# Altium project ADC-RDC.PrjPcb
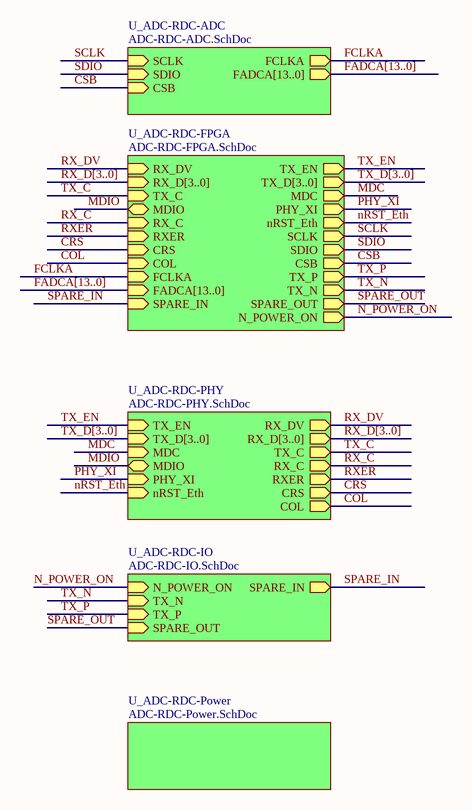
[diagram p0: ADC-RDC.SchDoc]
6 sheets, 188 parts. Net scope: hierarchical (ports join the sheet entries above them; power ports are global).
Board file: ADC-RDC.PcbDoc
Sheets:
  ADC-RDC.SchDoc
    U_ADC-RDC-ADC = ADC-RDC-ADC.SchDoc
    U_ADC-RDC-PHY = ADC-RDC-PHY.SchDoc
    U_ADC-RDC-Power = ADC-RDC-Power.SchDoc
    U_ADC-RDC-IO = ADC-RDC-IO.SchDoc
    U_ADC-RDC-FPGA = ADC-RDC-FPGA.SchDoc

## Sheet ADC-RDC.SchDoc
size A4

### Sub-sheets
U_ADC-RDC-ADC = ADC-RDC-ADC.SchDoc: SCLK (in), SDIO (in), CSB (in), FCLKA (out), FADCA[13..0] (out)
U_ADC-RDC-FPGA = ADC-RDC-FPGA.SchDoc: TX_EN (out), TX_D[3..0] (out), RX_DV (in), RX_D[3..0] (in), TX_C (in), MDC (out), MDIO (bidir), PHY_XI (out), nRST_Eth (out), RX_C (in), RXER (in), CRS (in), COL (in), FCLKA (in), FADCA[13..0] (in), SCLK (out), SDIO (out), CSB (out), TX_P (out), TX_N (out), SPARE_OUT (out), SPARE_IN (in), N_POWER_ON (out)
U_ADC-RDC-IO = ADC-RDC-IO.SchDoc: N_POWER_ON (in), TX_P (in), TX_N (in), SPARE_OUT (in), SPARE_IN (out)
U_ADC-RDC-PHY = ADC-RDC-PHY.SchDoc: TX_EN (in), TX_D[3..0] (in), RX_DV (out), RX_D[3..0] (out), TX_C (out), MDC (in), MDIO (bidir), PHY_XI (in), nRST_Eth (in), RX_C (out), RXER (out), CRS (out), COL (out)
U_ADC-RDC-Power = ADC-RDC-Power.SchDoc: no entries

### Nets
COL: sheet U_ADC-RDC-PHY/COL, sheet U_ADC-RDC-FPGA/COL
CRS: sheet U_ADC-RDC-PHY/CRS, sheet U_ADC-RDC-FPGA/CRS
CSB: sheet U_ADC-RDC-ADC/CSB, sheet U_ADC-RDC-FPGA/CSB
FCLKA: sheet U_ADC-RDC-ADC/FCLKA, sheet U_ADC-RDC-FPGA/FCLKA
MDC: sheet U_ADC-RDC-PHY/MDC, sheet U_ADC-RDC-FPGA/MDC
MDIO: sheet U_ADC-RDC-PHY/MDIO, sheet U_ADC-RDC-FPGA/MDIO
N_POWER_ON: sheet U_ADC-RDC-IO/N_POWER_ON, sheet U_ADC-RDC-FPGA/N_POWER_ON
nRST_Eth: sheet U_ADC-RDC-PHY/nRST_Eth, sheet U_ADC-RDC-FPGA/nRST_Eth
PHY_XI: sheet U_ADC-RDC-PHY/PHY_XI, sheet U_ADC-RDC-FPGA/PHY_XI
RX_C: sheet U_ADC-RDC-PHY/RX_C, sheet U_ADC-RDC-FPGA/RX_C
RX_DV: sheet U_ADC-RDC-PHY/RX_DV, sheet U_ADC-RDC-FPGA/RX_DV
RXER: sheet U_ADC-RDC-PHY/RXER, sheet U_ADC-RDC-FPGA/RXER
SCLK: sheet U_ADC-RDC-ADC/SCLK, sheet U_ADC-RDC-FPGA/SCLK
SDIO: sheet U_ADC-RDC-ADC/SDIO, sheet U_ADC-RDC-FPGA/SDIO
SPARE_IN: sheet U_ADC-RDC-IO/SPARE_IN, sheet U_ADC-RDC-FPGA/SPARE_IN
SPARE_OUT: sheet U_ADC-RDC-IO/SPARE_OUT, sheet U_ADC-RDC-FPGA/SPARE_OUT
TX_C: sheet U_ADC-RDC-PHY/TX_C, sheet U_ADC-RDC-FPGA/TX_C
TX_EN: sheet U_ADC-RDC-PHY/TX_EN, sheet U_ADC-RDC-FPGA/TX_EN
TX_N: sheet U_ADC-RDC-IO/TX_N, sheet U_ADC-RDC-FPGA/TX_N
TX_P: sheet U_ADC-RDC-IO/TX_P, sheet U_ADC-RDC-FPGA/TX_P

### Buses and harness runs
bus FADCA[13..0] = sheet U_ADC-RDC-ADC/FADCA[13..0]
bus FADCA[13..0] = sheet U_ADC-RDC-FPGA/FADCA[13..0]
bus RX_D[3..0] = sheet U_ADC-RDC-FPGA/RX_D[3..0]
bus RX_D[3..0] = sheet U_ADC-RDC-PHY/RX_D[3..0]
bus TX_D[3..0] = sheet U_ADC-RDC-FPGA/TX_D[3..0]
bus TX_D[3..0] = sheet U_ADC-RDC-PHY/TX_D[3..0]

## Sheet ADC-RDC-ADC.SchDoc
size A3
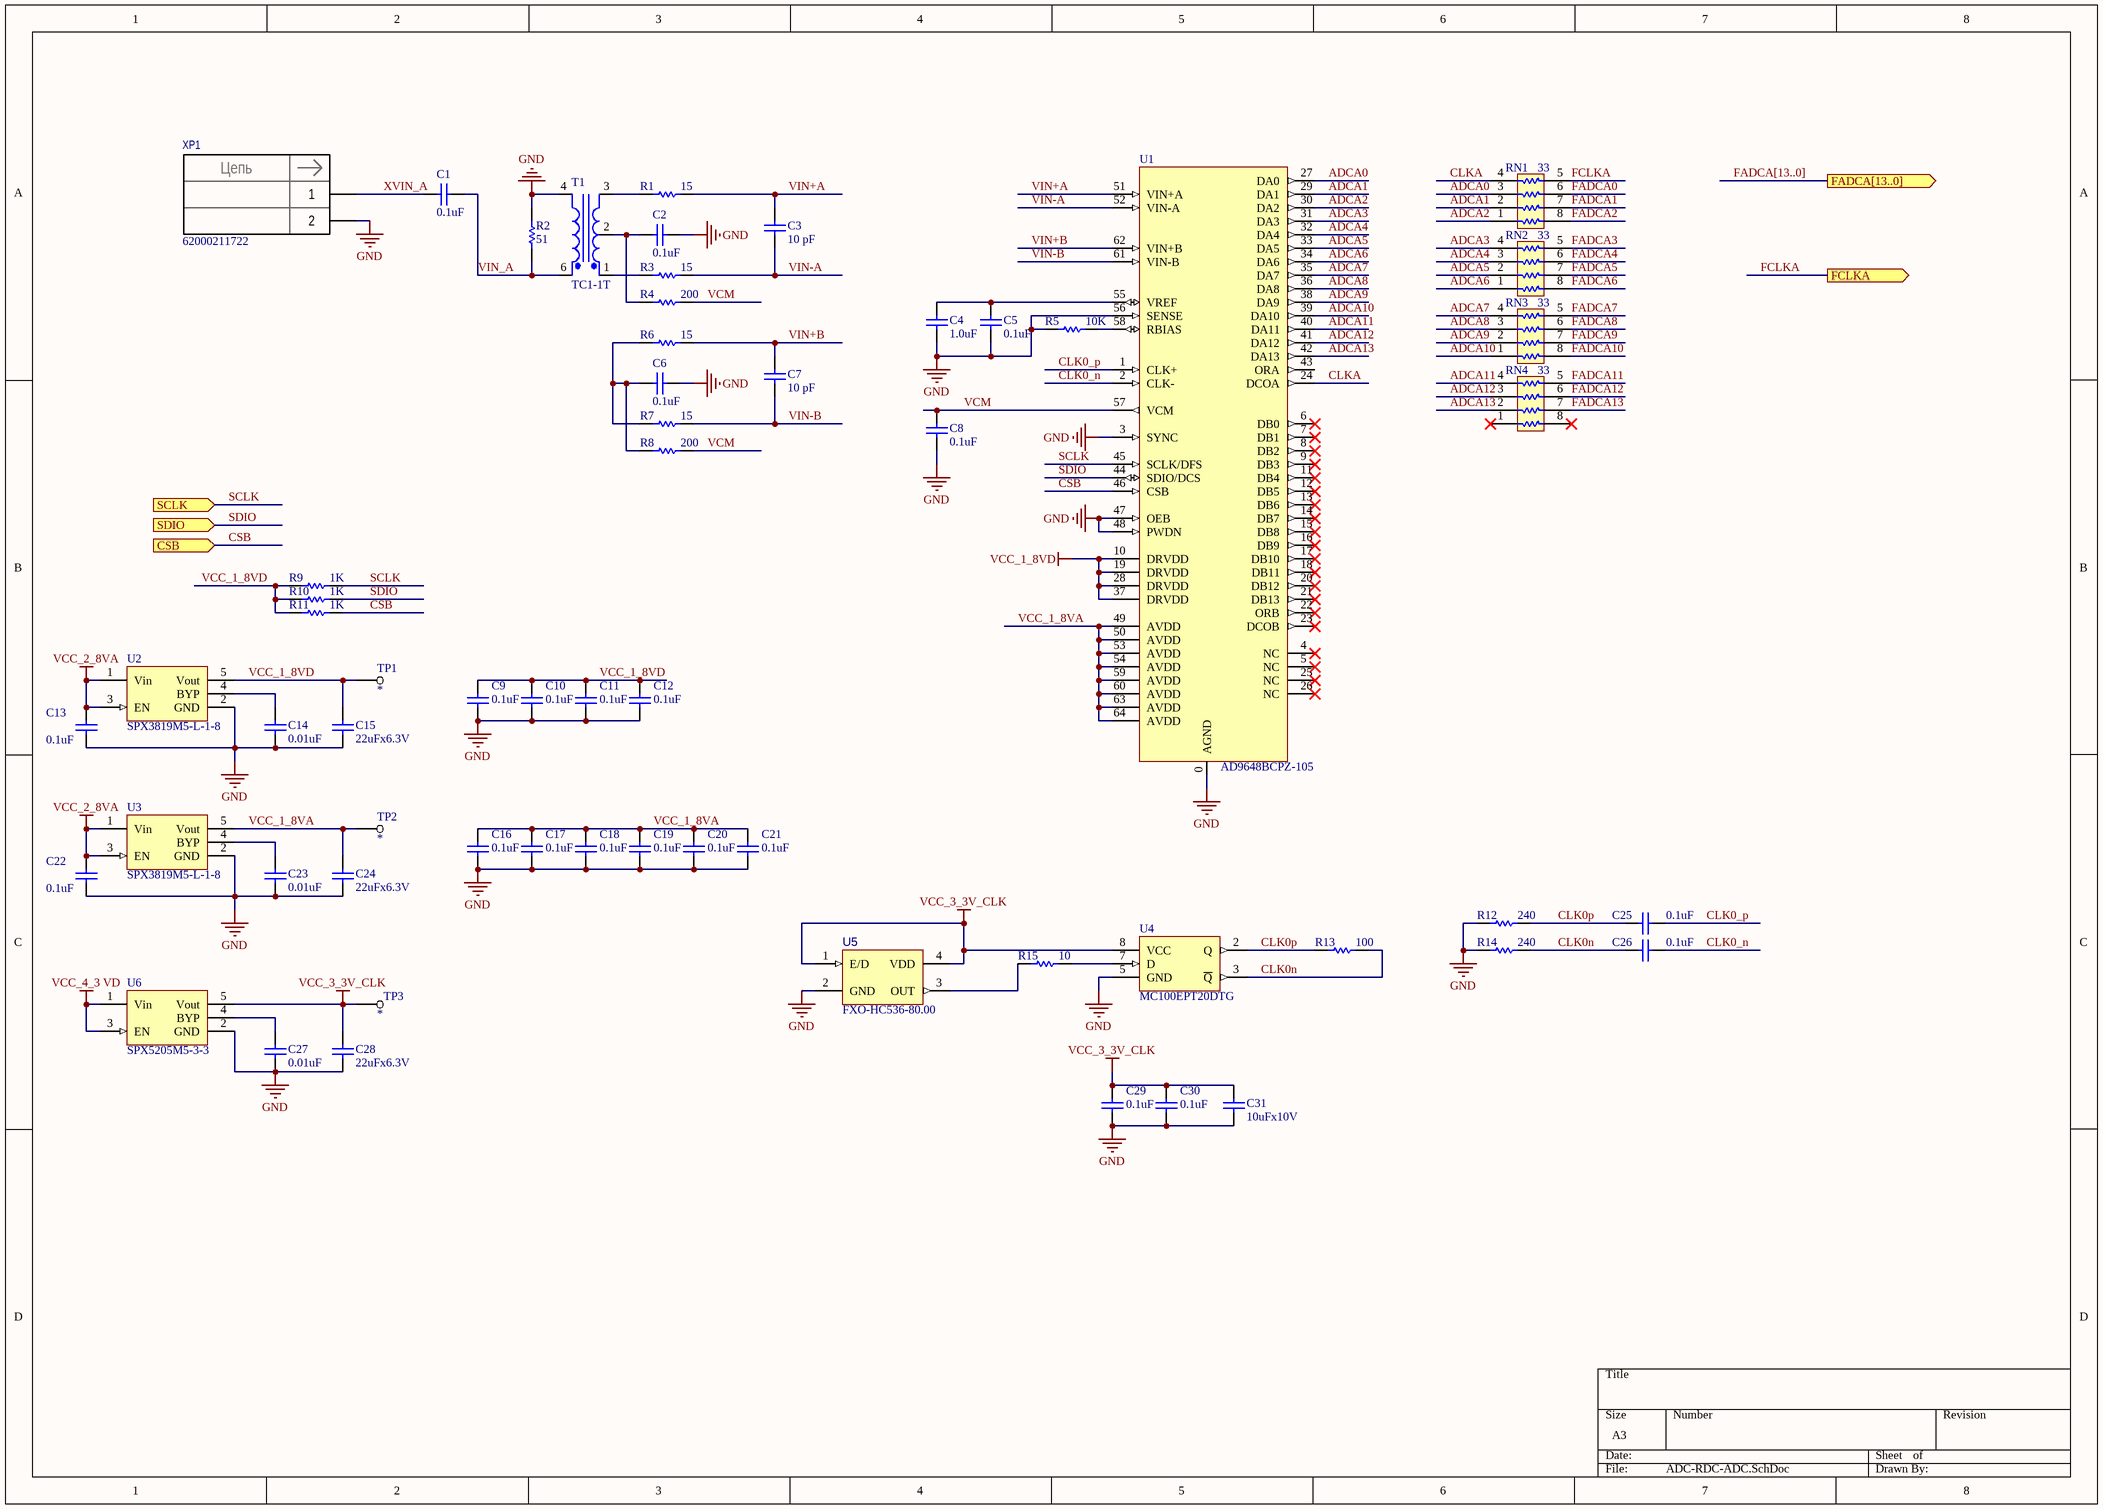
[diagram p1: ADC-RDC-ADC.SchDoc]

### Parts
C1  0.1uF  [C0603]
C2  0.1uF  [C0603]
C3  10 pF  [C0603]
C4  1.0uF  [C0603L]
C5  0.1uF  [C0603L]
C6  0.1uF  [C0603]
C7  10 pF  [C0603]
C8  0.1uF  [C0603L]
C9  0.1uF  [C0603]
C10  0.1uF  [C0603]
C11  0.1uF  [C0603]
C12  0.1uF  [C0603]
C13  0.1uF  [C0603]
C14  0.01uF  [C0603]
C15  22uFx6.3V  [C0805]
C16  0.1uF  [C0603L]
C17  0.1uF  [C0603L]
C18  0.1uF  [C0603L]
C19  0.1uF  [C0603L]
C20  0.1uF  [C0603L]
C21  0.1uF  [C0603L]
C22  0.1uF  [C0603]
C23  0.01uF  [C0603]
C24  22uFx6.3V  [C0805]
C25  0.1uF  [C0603L]
C26  0.1uF  [C0603L]
C27  0.01uF  [C0603]
C28  22uFx6.3V  [C0805]
C29  0.1uF  [C0603]
C30  0.1uF  [C0603]
C31  10uFx10V  [C0805]
R1  15  [R0603]
R2  51  [R0805]
R3  15  [R0603]
R4  200  [R0603]
R5  10K  [R0603L]
R6  15  [R0603]
R7  15  [R0603]
R8  200  [R0603]
R9  1K  [R0603]
R10  1K  [R0603]
R11  1K  [R0603]
R12  240  [R0603]
R13  100  [R0603]
R14  240  [R0603]
R15  10  [R0603]
RN1  33  [EXB38V]
RN2  33  [EXB38V]
RN3  33  [EXB38V]
RN4  33  [EXB38V]
T1  TC1-1T  [SM-22]
TP1  *  [TP_1_06]  (no BOM)
TP2  *  [TP_1_06]  (no BOM)
TP3  *  [TP_1_06]  (no BOM)
U1  AD9648BCPZ-105  [CP-64-4]
U2  SPX3819M5-L-1-8  [SOT23-5]
U3  SPX3819M5-L-1-8  [SOT23-5]
U4  MC100EPT20DTG  [TSSOP8]
U5  FXO-HC536-80.00  [HC5]
U6  SPX5205M5-3-3  [SOT23-5]
XP1  Component_name: 62000211722  [conP_WR-WTB_62000211722-2pin_P2000_60x76x48_L]  (hidden comment: plug_62000211722_WR-WTB_2pin_horiz)

### Ports
CSB (in), FADCA[13..0] (out), FCLKA (out), SCLK (in), SDIO (in)

### Nets
GND: C2.2 C4.1 C5.1 C6.2 C8.1 C9.1 C10.1 C11.1 C12.1 C13.1 C14.1 C15.1 C16.1 C17.1 C18.1 C19.1 C20.1 C21.1 C22.1 C23.1 C24.1 C27.1 C28.1 C29.1 C30.1 C31.1 R2.2 R5.1 R12.1 R14.1 T1.4(Pri-) U1.0(AGND) U1.3(SYNC) U1.47(OEB) U1.48(PWDN) U1.56(SENSE) U2.2(GND) U3.2(GND) U4.5(GND) U5.2(GND) U6.2(GND) XP1.2
VCC_1_8VD: C9.2 C10.2 C11.2 C12.2 C15.2 R9.1 R10.1 R11.1 TP1.1 U1.10(DRVDD) U1.19(DRVDD) U1.28(DRVDD) U1.37(DRVDD) U2.5(Vout)
VCC_2_8VA: C13.2 C22.2 U2.1(Vin) U2.3(EN) U3.1(Vin) U3.3(EN)
VCC_3_3V_CLK: C28.2 C29.2 C30.2 C31.2 TP3.1 U4.8(VCC) U5.1(E/D) U5.4(VDD) U6.5(Vout)
VCC_4_3 VD: U6.1(Vin) U6.3(EN)
ADCA0: RN1.3 U1.27(DA0)
ADCA1: RN1.2 U1.29(DA1)
ADCA2: RN1.1 U1.30(DA2)
ADCA3: RN2.4 U1.31(DA3)
ADCA4: RN2.3 U1.32(DA4)
ADCA5: RN2.2 U1.33(DA5)
ADCA6: RN2.1 U1.34(DA6)
ADCA7: RN3.4 U1.35(DA7)
ADCA8: RN3.3 U1.36(DA8)
ADCA9: RN3.2 U1.38(DA9)
ADCA10: RN3.1 U1.39(DA10)
ADCA11: RN4.4 U1.40(DA11)
ADCA12: RN4.3 U1.41(DA12)
ADCA13: RN4.2 U1.42(DA13)
CLK0_n: C26.2 U1.2(CLK-)
CLK0_p: C25.2 U1.1(CLK+)
CLK0n: C26.1 R13.2 R14.2 U4.3(~{Q})
CLK0p: C25.1 R12.2 R13.1 U4.2(Q)
CLKA: RN1.4 U1.24(DCOA)
CSB: R11.2 U1.46(CSB) ; port CSB
FADCA0: RN1.6
FADCA1: RN1.7
FADCA2: RN1.8
FADCA3: RN2.5
FADCA4: RN2.6
FADCA5: RN2.7
FADCA6: RN2.8
FADCA7: RN3.5
FADCA8: RN3.6
FADCA9: RN3.7
FADCA10: RN3.8
FADCA11: RN4.5
FADCA12: RN4.6
FADCA13: RN4.7
FCLKA: RN1.5 ; port FCLKA
SCLK: R9.2 U1.45(SCLK/DFS) ; port SCLK
SDIO: R10.2 U1.44(SDIO/DCS) ; port SDIO
VCC_1_8VA: C16.2 C17.2 C18.2 C19.2 C20.2 C21.2 C24.2 TP2.1 U1.49(AVDD) U1.50(AVDD) U1.53(AVDD) U1.54(AVDD) U1.59(AVDD) U1.60(AVDD) U1.63(AVDD) U1.64(AVDD) U3.5(Vout)
VCM: C8.2 R4.2 R8.2 U1.57(VCM)
VIN+A: C3.1 R1.2 U1.51(VIN+A)
VIN+B: C7.1 R6.2 U1.62(VIN+B)
VIN-A: C3.2 R3.2 U1.52(VIN-A)
VIN-B: C7.2 R7.2 U1.61(VIN-B)
VIN_A: C1.1 R2.1 T1.6(Pri+)
XVIN_A: C1.2 XP1.1
NetC2_1: C2.1 R4.1 T1.2(SecCT)
NetC4_2: C4.2 C5.2 U1.55(VREF)
NetC6_1: C6.1 R6.1 R7.1 R8.1
NetC14_2: C14.2 U2.4(BYP)
NetC23_2: C23.2 U3.4(BYP)
NetC27_2: C27.2 U6.4(BYP)
NetR1_1: R1.1 T1.3(Sec-)
NetR3_1: R3.1 T1.1(Sec+)
NetR5_2: R5.2 U1.58(RBIAS)
NetR15_1: R15.1 U5.3(OUT)
NetR15_2: R15.2 U4.7(D)

Not connected (* = marked no-connect by the designer): RN4 1* 8*; U1 4(NC)* 5(NC)* 6(DB0)* 7(DB1)* 8(DB2)* 9(DB3)* 11(DB4)* 12(DB5)* 13(DB6)* 14(DB7)* 15(DB8)* 16(DB9)* 17(DB10)* 18(DB11)* 20(DB12)* 21(DB13)* 22(ORB)* 23(DCOB)* 25(NC)* 26(NC)* 43(ORA)

### Buses and harness runs
bus FADCA[13..0] = port FADCA[13..0]

### Notes on the sheet
- (in symbol plug_62000211722_WR-WTB_2pin_horiz) Цепь

### Library data of the parts
C1-C31 = Cap: Capacitor, 2pin; ValueSCH: *; ValueBOM: *; MarkPCB: *
R1-R15 = RES: Resistor, 2pin; ValueSCH: *; ValueBOM: *; MarkPCB: *
RN1-RN4 = x4 Resistor Array: ValueSCH: *; ValueBOM: *; MarkPCB: *
T1 = TC1-1T: Center-Tapped Transformer (Ideal)
TP1-TP3 = Test_point: Test point; ValueSCH: *; ValueBOM: *; MarkPCB: *
U1 = AD9648BCPZ-105: 14-Bit, 125 MSPS/105 MSPS, 1.8 V Dual  Analog-to-Digital Converter; MarkPCB: *; ValueBOM: *; ValueSCH: *
U2 U3 = SPX3819M5-L-1-8: LDO Voltage Regulator; ValueSCH: *; ValueBOM: *; MarkPCB: *
U4 = MC100EPT20DT: 3.3 V TTL/CMOS to differential PECL translator; ValueSCH: *; ValueBOM: *; MarkPCB: *
U5 = SG-636PTF-40.0000: Surface Mount Crystal Oscillator; MarkPCB: *; ValueBOM: *; ValueSCH: *
U6 = SPX5205M5-3-3: LDO Voltage Regulator; ValueSCH: *; ValueBOM: *; MarkPCB: *
XP1 = plug_62000211722_WR-WTB_2pin_horiz: 2.00mm Male Horizontal Shrouded Header WR-WTB; Part_number_PROSA: D-VI-6267; Manufacturer: "Wurth Elektronik"; LxWxH(mm): 6,0x7,6x4,8; Area(mm2): 45,6; Number_of_pads: 2; Mounting_type: Standard; Component_ID: plug_62000211722_WR-WTB_2pin_horiz; Component Class: Plug_PCB_mounting; Type: Вилки; PROSA_name (Old name): 62000211722; Package: conP_WR-WTB_62000211722-2pin_P2000_60x76x48; Case_code: WR-WTB_2pin_horiz; Height(mm): 4,8; ComponentLink1Description: plug_62000211722.pdf; ComponentLink1URL: C:\chkout_AltiumLib\Datasheets\Electromechanics_datasheet\Connectors\plug_62000211722.pdf; HelpURL: C:\chkout_AltiumLib\Datasheets\Electromechanics_datasheet\Connectors\plug_62000211722.pdf; ComponentLink2Description: plug_62000211722_URL_Link; ComponentLink2URL: http://katalog.we-online.com/en/em/WTB_2_00_MALE_HORIZONTAL_SHROUDED_HEADER_6200XX11722/62000211722?sid=a40b27176d

## Sheet ADC-RDC-PHY.SchDoc
size A4
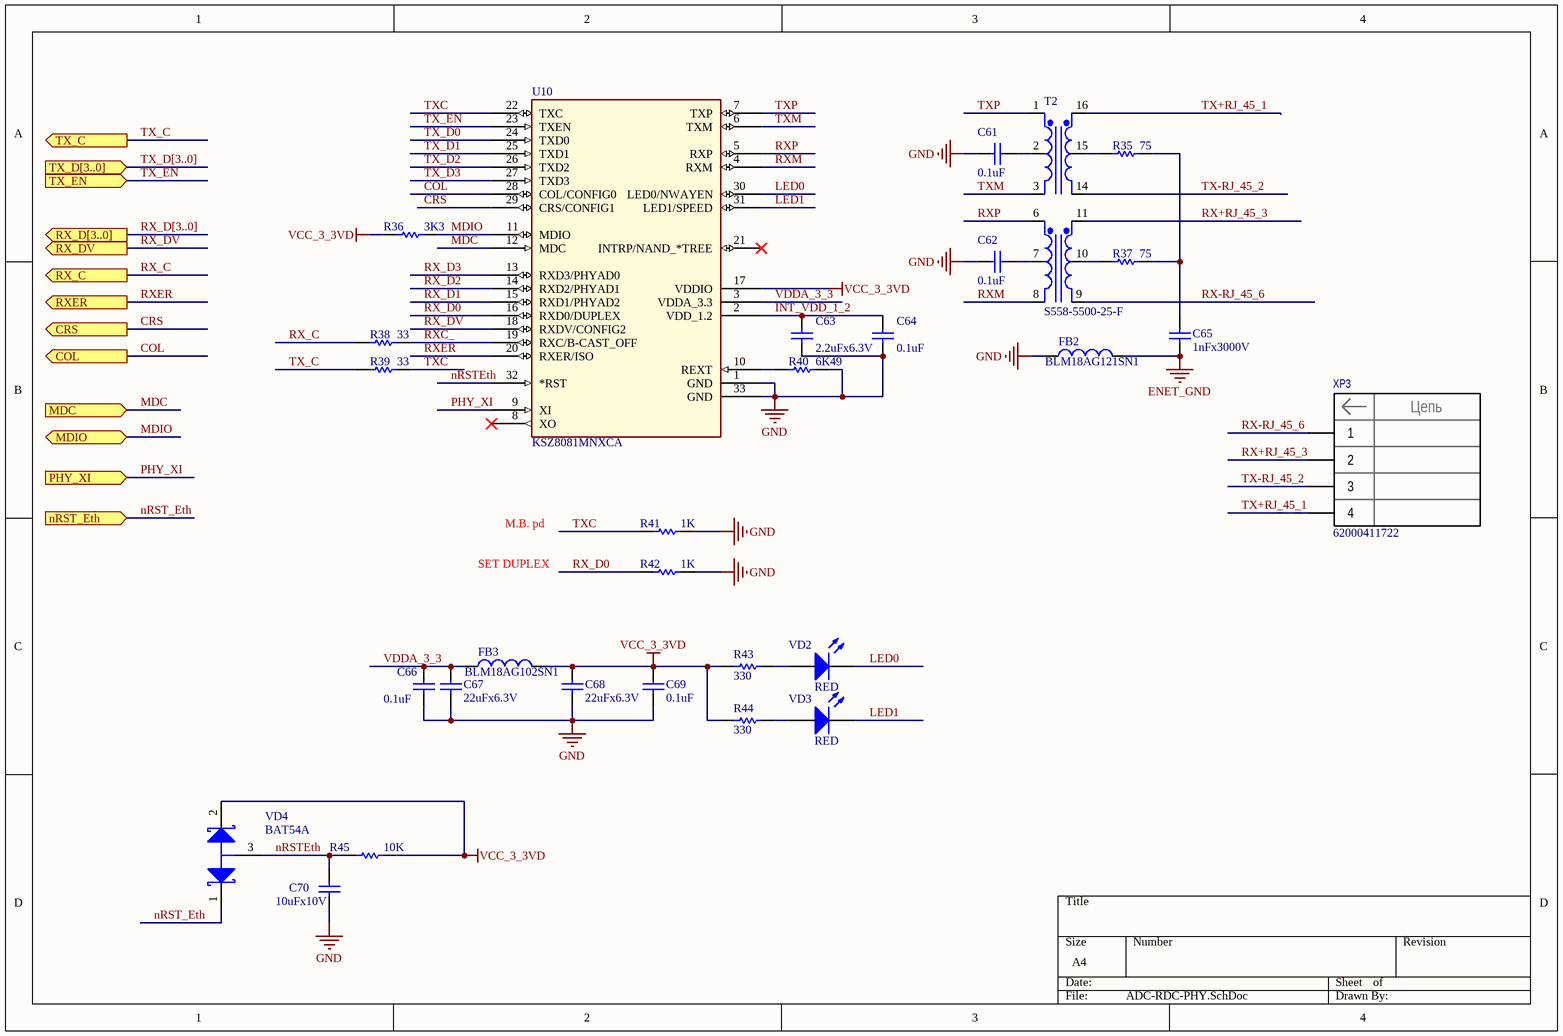
[diagram p2: ADC-RDC-PHY.SchDoc]

### Parts
C61  0.1uF  [C0603]
C62  0.1uF  [C0603]
C63  2.2uFx6.3V  [C0603]
C64  0.1uF  [C0603]
C65  1nFx3000V  [C1808]
C66  0.1uF  [C0603]
C67  22uFx6.3V  [C0805]
C68  22uFx6.3V  [C0805]
C69  0.1uF  [C0603]
C70  10uFx10V  [C0805]
FB2  BLM18AG121SN1  [R0603]
FB3  BLM18AG102SN1  [R0603]
R35  75  [R0603]
R36  3K3  [R0603]
R37  75  [R0603]
R38  33  [R0603]
R39  33  [R0603]
R40  6K49  [R0603]
R41  1K  [R0603]
R42  1K  [R0603]
R43  330  [R0603]
R44  330  [R0603]
R45  10K  [R0603]
T2  S558-5500-25-F  [N5]
U10  KSZ8081MNXCA  [QFN32_L]
VD2  RED  [D0805]
VD3  RED  [D0805]
VD4  BAT54A  [SOT-23]
XP3  Component_name: 62000411722  [conP_WR-WTB_62000411722-4pin_P2000_100x76x48_L]  (hidden comment: plug_62000411722_WR-WTB_4pin_horiz)

### Ports
COL (out), CRS (out), MDC (in), MDIO (bidir), nRST_Eth (in), PHY_XI (in), RX_C (out), RX_D[3..0] (out), RX_DV (out), RXER (out), TX_C (out), TX_D[3..0] (in), TX_EN (in)

### Nets
ENET_GND: C65.2 FB2.1
GND: C61.2 C62.2 C63.2 C64.1 C66.1 C67.1 C68.1 C69.1 C70.2 FB2.2 R40.2 R41.2 R42.2 U10.1(GND) U10.33(GND)
VCC_3_3VD: C68.2 C69.2 FB3.1 R36.1 R43.2 R44.2 R45.2 U10.17(VDDIO) VD4.2(A2)
COL: U10.28(COL/CONFIG0) ; port COL
CRS: U10.29(CRS/CONFIG1) ; port CRS
INT_VDD_1_2: C63.1 C64.2 U10.2(VDD_1.2)
LED0: U10.30(LED0/NWAYEN) VD2.2(K)
LED1: U10.31(LED1/SPEED) VD3.2(K)
MDC: U10.12(MDC) ; port MDC
MDIO: R36.2 U10.11(MDIO) ; port MDIO
nRST_Eth: VD4.1(A1) ; port nRST_Eth
nRSTEth: C70.1 R45.1 U10.32(*RST) VD4.3(K)
PHY_XI: U10.9(XI) ; port PHY_XI
RX+RJ_45_3: T2.11(Pri2+) XP3.2
RX-RJ_45_6: T2.9(Pri2-) XP3.1
RX_C: R38.1 ; port RX_C
RX_D0: R42.1 U10.16(RXD0/DUPLEX)
RX_D1: U10.15(RXD1/PHYAD2)
RX_D2: U10.14(RXD2/PHYAD1)
RX_D3: U10.13(RXD3/PHYAD0)
RX_DV: U10.18(RXDV/CONFIG2) ; port RX_DV
RXC_: R38.2 U10.19(RXC/B-CAST_OFF)
RXER: U10.20(RXER/ISO) ; port RXER
RXM: T2.8(Sec2-) U10.4(RXM)
RXP: T2.6(Sec2+) U10.5(RXP)
TX+RJ_45_1: T2.16(Pri1+) XP3.4
TX-RJ_45_2: T2.14(Pri1-) XP3.3
TX_C: R39.1 ; port TX_C
TX_D0: U10.24(TXD0)
TX_D1: U10.25(TXD1)
TX_D2: U10.26(TXD2)
TX_D3: U10.27(TXD3)
TX_EN: U10.23(TXEN) ; port TX_EN
TXC: R39.2 R41.1 U10.22(TXC)
TXM: T2.3(Sec1-) U10.6(TXM)
TXP: T2.1(Sec1+) U10.7(TXP)
VDDA_3_3: C66.2 C67.2 FB3.2 U10.3(VDDA_3.3)
NetC61_1: C61.1 T2.2(Sec1CT)
NetC62_1: C62.1 T2.7(Sec2CT)
NetC65_1: C65.1 R35.2 R37.2
NetR35_1: R35.1 T2.15(Pri1CT)
NetR37_1: R37.1 T2.10(Pri2CT)
NetR40_1: R40.1 U10.10(REXT)
NetR43_1: R43.1 VD2.1(A)
NetR44_1: R44.1 VD3.1(A)

Not connected (* = marked no-connect by the designer): U10 8(XO)* 21(INTRP/NAND_*TREE)*

### Buses and harness runs
bus RX_D[3..0] = port RX_D[3..0]
bus TX_D[3..0] = port TX_D[3..0]

### Notes on the sheet
- SET DUPLEX
- M.B. pd
- (in symbol plug_62000411722_WR-WTB_4pin_horiz) Цепь

### Library data of the parts
C61-C70 = Cap: Capacitor, 2pin; ValueSCH: *; ValueBOM: *; MarkPCB: *
FB2 FB3 = Inductor: Inductor, 2pin; ValueSCH: *; ValueBOM: *; MarkPCB: *
R35-R45 = RES: Resistor, 2pin; ValueSCH: *; ValueBOM: *; MarkPCB: *
T2 = TG110-E050N5: Center-Tapped Transformer (Ideal); ValueSCH: *; MarkPCB: *
U10 = KSZ8081MNXCA: 10BASE-T/100BASE-TX Physical Layer Transceiver; ValueBOM: *; ValueSCH: *
VD2 VD3 = LED: Typical GaAs LED; ValueSCH: *; ValueBOM: *; MarkPCB: *
VD4 = BAT54A: Schottky Barrier Double Diode; ValueSCH: *; ValueBOM: *; MarkPCB: *
XP3 = plug_62000411722_WR-WTB_4pin_horiz: 2.00mm Male Vertical Shrouded Header WR-WTB; Part_number_PROSA: D-VI-6034; Manufacturer: "Wurth Elektronik"; LxWxH(mm): 10,0x7,6x4,8; Area(mm2): 76; Number_of_pads: 4; Mounting_type: Standard; Component_ID: plug_62000411722_WR-WTB_4pin_horiz; Component Class: Plug_PCB_mounting; Type: Вилки; PROSA_name (Old name): 62000411722; Package: conP_WR-WTB_62000411722-4pin_P2000_100x76x48; Case_code: WR-WTB_4pin_horiz; Height(mm): 4,8; ComponentLink1Description: plug_62000411722.pdf; ComponentLink1URL: C:\chkout_AltiumLib\Datasheets\Electromechanics_datasheet\Connectors\plug_62000411722.pdf; HelpURL: C:\chkout_AltiumLib\Datasheets\Electromechanics_datasheet\Connectors\plug_62000411722.pdf; ComponentLink2Description: plug_62000411722_URL_Link; ComponentLink2URL: http://katalog.we-online.de/en/em/WTB_2_00_MALE_VERTICAL_SHROUDED_HEADER_6200XX11622

## Sheet ADC-RDC-Power.SchDoc
size A4
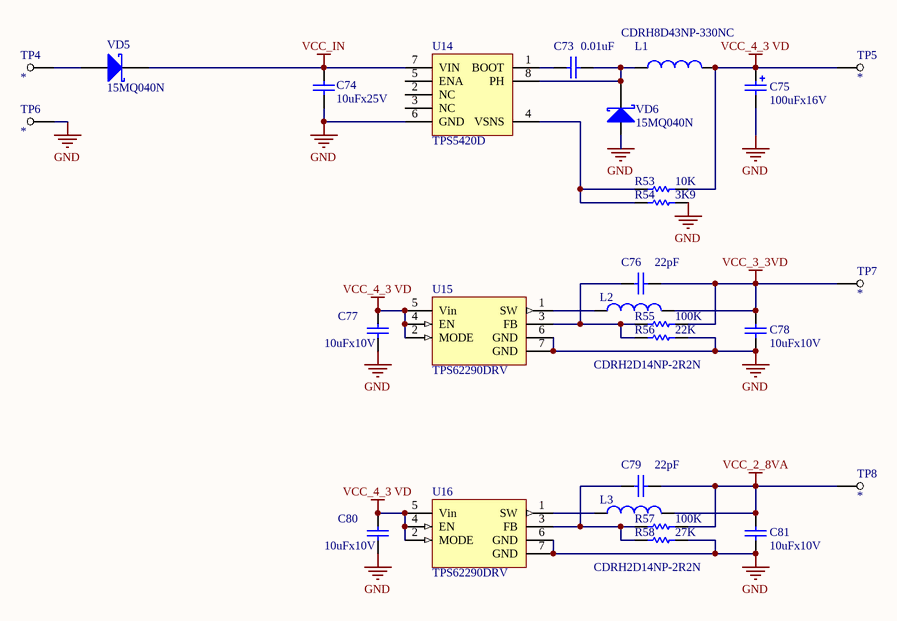
[diagram p3: ADC-RDC-Power.SchDoc]

### Parts
C73  0.01uF  [C0603]
C74  10uFx25V  [C1210]
C75  100uFx16V  [SIZE E]
C76  22pF  [C0603]
C77  10uFx10V  [C0805]
C78  10uFx10V  [C0805]
C79  22pF  [C0603]
C80  10uFx10V  [C0805]
C81  10uFx10V  [C0805]
L1  CDRH8D43NP-330NC  [CDRH8D43]
L2  CDRH2D14NP-2R2N  [CDRH2D18]
L3  CDRH2D14NP-2R2N  [CDRH2D18]
R53  10K  [R0603]
R54  3K9  [R0603]
R55  100K  [R0603]
R56  22K  [R0603]
R57  100K  [R0603]
R58  27K  [R0603]
TP4  *  [TP_18_10]  (no BOM)
TP5  *  [TP_1_06]  (no BOM)
TP6  *  [TP_18_10]  (no BOM)
TP7  *  [TP_1_06]  (no BOM)
TP8  *  [TP_1_06]  (no BOM)
U14  TPS5420D  [SOIC8]
U15  TPS62290DRV  [SON6]
U16  TPS62290DRV  [SON6]
VD5  15MQ040N  [SMA]
VD6  15MQ040N  [SMA]

### Nets
GND: C74.2 C75.2 C77.2 C78.2 C80.2 C81.2 R54.2 R56.2 R58.2 TP6.1 U14.6(GND) U15.6(GND) U15.7(GND) U16.6(GND) U16.7(GND) VD6.1(A)
VCC_2_8VA: C79.1 C81.1 L3.2 R57.2 TP8.1
VCC_3_3VD: C76.1 C78.1 L2.2 R55.2 TP7.1
VCC_4_3 VD: C75.1 C77.1 C80.1 L1.2 R53.2 TP5.1 U15.2(MODE) U15.4(EN) U15.5(Vin) U16.2(MODE) U16.4(EN) U16.5(Vin)
VCC_IN: C74.1 U14.7(VIN) VD5.2(K)
NetC73_1: C73.1 U14.1(BOOT)
NetC73_2: C73.2 L1.1 U14.8(PH) VD6.2(K)
NetC76_2: C76.2 R55.1 R56.1 U15.3(FB)
NetC79_2: C79.2 R57.1 R58.1 U16.3(FB)
NetL2_1: L2.1 U15.1(SW)
NetL3_1: L3.1 U16.1(SW)
NetR53_1: R53.1 R54.1 U14.4(VSNS)
NetTP4_1: TP4.1 VD5.1(A)

Not connected (* = marked no-connect by the designer): U14 2(NC) 3(NC) 5(ENA)

### Library data of the parts
C73 C74 C76-C81 = Cap: Capacitor, 2pin; ValueSCH: *; ValueBOM: *; MarkPCB: *
C75 = Cap Pol: Polarized Capacitor, 2pin; ValueSCH: *; ValueBOM: *; MarkPCB: *
L1-L3 = Inductor: Inductor, 2pin; ValueSCH: *; ValueBOM: *; MarkPCB: *
R53-R58 = RES: Resistor, 2pin; ValueSCH: *; ValueBOM: *; MarkPCB: *
TP4-TP8 = Test_point: Test point; ValueSCH: *; ValueBOM: *; MarkPCB: *
U14 = TPS5420: 2-A, WIDE INPUT RANGE, STEP-DOWN SWIFT™ CONVERTER; ValueSCH: *; ValueBOM: *; MarkPCB: *
U15 U16 = TPS62290: 1-A Step Down Converter in 2 x 2 SON Package; ValueSCH: *; ValueBOM: *; MarkPCB: *
VD5 VD6 = D Schottky: Schottky Diode, 2pin; ValueSCH: *; ValueBOM: *; MarkPCB: *

## Sheet ADC-RDC-IO.SchDoc
size A4
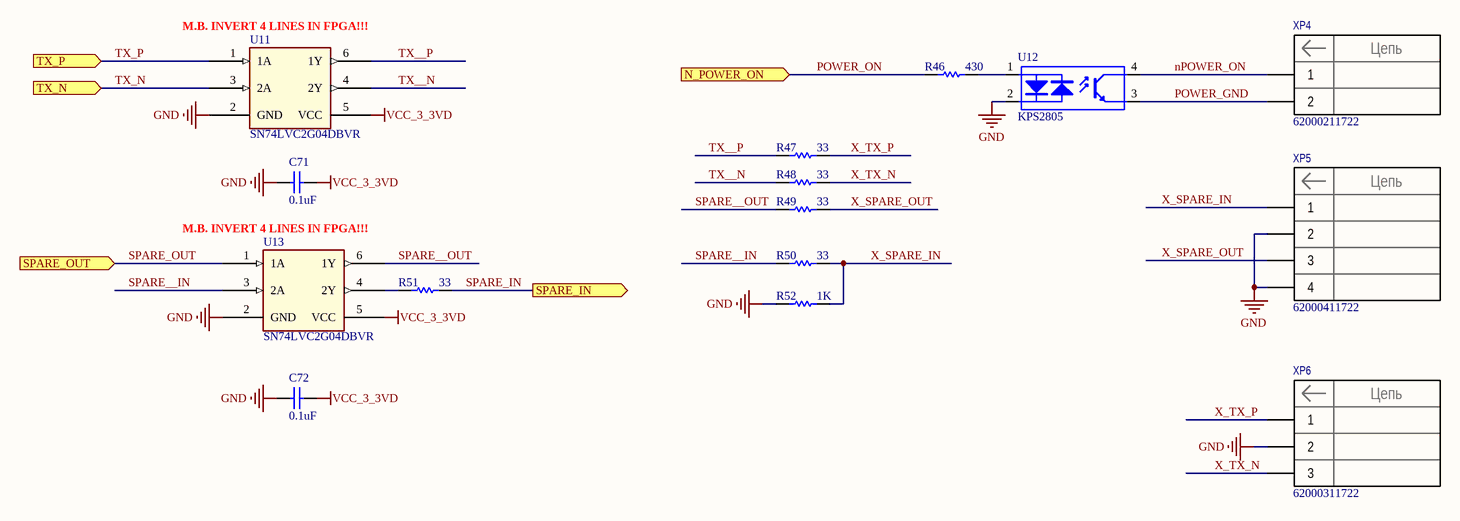
[diagram p4: ADC-RDC-IO.SchDoc]

### Parts
C71  0.1uF  [C0603]
C72  0.1uF  [C0603]
R46  430  [R0603]
R47  33  [R0603]
R48  33  [R0603]
R49  33  [R0603]
R50  33  [R0603]
R51  33  [R0603]
R52  1K  [R0603]
U11  SN74LVC2G04DBVR  [SOT23-6]
U12  KPS2805  [SOP4]
U13  SN74LVC2G04DBVR  [SOT23-6]
XP4  Component_name: 62000211722  [conP_WR-WTB_62000211722-2pin_P2000_60x76x48_L]  (hidden comment: plug_62000211722_WR-WTB_2pin_horiz)
XP5  Component_name: 62000411722  [conP_WR-WTB_62000411722-4pin_P2000_100x76x48_L]  (hidden comment: plug_62000411722_WR-WTB_4pin_horiz)
XP6  Component_name: 62000311722  [conP_WR-WTB_62000311722-3pin_P2000_80x76x48_L]  (hidden comment: plug_62000311722_WR-WTB_3pin_horiz)

### Ports
N_POWER_ON (in), SPARE_IN (out), SPARE_OUT (in), TX_N (in), TX_P (in)

### Nets
GND: C71.1 C72.1 R52.1 U11.2(GND) U12.2(K) U13.2(GND) XP5.2 XP5.4 XP6.2
VCC_3_3VD: C71.2 C72.2 U11.5(VCC) U13.5(VCC)
POWER_GND: U12.3(E) XP4.2
POWER_ON: R46.1 ; port N_POWER_ON  [project net N_POWER_ON]
SPARE__IN: R50.1 U13.3(2A)
SPARE__OUT: R49.1 U13.6(1Y)
SPARE_IN: R51.2 ; port SPARE_IN
SPARE_OUT: U13.1(1A) ; port SPARE_OUT
TX__N: R48.1 U11.4(2Y)
TX__P: R47.1 U11.6(1Y)
TX_N: U11.3(2A) ; port TX_N
TX_P: U11.1(1A) ; port TX_P
X_SPARE_IN: R50.2 R52.2 XP5.1
X_SPARE_OUT: R49.2 XP5.3
X_TX_N: R48.2 XP6.3
X_TX_P: R47.2 XP6.1
NetR46_2: R46.2 U12.1(A)
NetR51_1: R51.1 U13.4(2Y)
NetU12_4: U12.4(C) XP4.1

### Notes on the sheet
- (near U11) M.B. INVERT 4 LINES IN FPGA!!!
- M.B. INVERT 4 LINES IN FPGA!!!
- Labels drawn without touching a wire or pin: nPOWER_ON
- (in symbol plug_62000211722_WR-WTB_2pin_horiz) Цепь
- (in symbol plug_62000311722_WR-WTB_3pin_horiz) Цепь
- (in symbol plug_62000411722_WR-WTB_4pin_horiz) Цепь

### Library data of the parts
C71 C72 = Cap: Capacitor, 2pin; ValueSCH: *; ValueBOM: *; MarkPCB: *
R46-R52 = RES: Resistor, 2pin; ValueSCH: *; ValueBOM: *; MarkPCB: *
U11 U13 = SN74LVC2G04DBVR: DUAL INVERTER GATE; ValueBOM: *; ValueSCH: *; MarkPCB: *
U12 = Optoisolator: Phototransistor Optocoupler, 4-Pin; ValueSCH: *; ValueBOM: *; MarkPCB: *
XP4 = plug_62000211722_WR-WTB_2pin_horiz: as XP1 on sheet ADC-RDC-ADC; Component_ID: plug_62000211722_WR-WTB_2pin_horiz; Component Class: Plug_PCB_mounting; Type: Вилки; PROSA_name (Old name): 62000211722; Package: conP_WR-WTB_62000211722-2pin_P2000_60x76x48; Case_code: WR-WTB_2pin_horiz; Height(mm): 4,8; ComponentLink1Description: plug_62000211722.pdf; ComponentLink1URL: C:\chkout_AltiumLib\Datasheets\Electromechanics_datasheet\Connectors\plug_62000211722.pdf; HelpURL: C:\chkout_AltiumLib\Datasheets\Electromechanics_datasheet\Connectors\plug_62000211722.pdf; ComponentLink2Description: plug_62000211722_URL_Link; ComponentLink2URL: http://katalog.we-online.com/en/em/WTB_2_00_MALE_HORIZONTAL_SHROUDED_HEADER_6200XX11722/62000211722?sid=a40b27176d
XP5 = plug_62000411722_WR-WTB_4pin_horiz: as XP3 on sheet ADC-RDC-PHY; Component_ID: plug_62000411722_WR-WTB_4pin_horiz; Component Class: Plug_PCB_mounting; Type: Вилки; PROSA_name (Old name): 62000411722; Package: conP_WR-WTB_62000411722-4pin_P2000_100x76x48; Case_code: WR-WTB_4pin_horiz; Height(mm): 4,8; ComponentLink1Description: plug_62000411722.pdf; ComponentLink1URL: C:\chkout_AltiumLib\Datasheets\Electromechanics_datasheet\Connectors\plug_62000411722.pdf; HelpURL: C:\chkout_AltiumLib\Datasheets\Electromechanics_datasheet\Connectors\plug_62000411722.pdf; ComponentLink2Description: plug_62000411722_URL_Link; ComponentLink2URL: http://katalog.we-online.de/en/em/WTB_2_00_MALE_VERTICAL_SHROUDED_HEADER_6200XX11622
XP6 = plug_62000311722_WR-WTB_3pin_horiz: 2.00mm Male Vertical Shrouded Header WR-WTB; Part_number_PROSA: D-VI-6523; Manufacturer: "Wurth Elektronik"; LxWxH(mm): 8,0x7,6x4,8; Area(mm2): 60,8; Number_of_pads: 3; Mounting_type: Standard; Component_ID: plug_62000311722_WR-WTB_3pin_horiz; Component Class: Plug_PCB_mounting; Type: Вилки; PROSA_name (Old name): 62000311722; Package: conP_WR-WTB_62000311722-3pin_P2000_80x76x48; Case_code: WR-WTB_3pin_horiz; Height(mm): 4,8; ComponentLink1Description: plug_62000311722.pdf; ComponentLink1URL: C:\chkout_AltiumLib\Datasheets\Electromechanics_datasheet\Connectors\plug_62000311722.pdf; HelpURL: C:\chkout_AltiumLib\Datasheets\Electromechanics_datasheet\Connectors\plug_62000311722.pdf; ComponentLink2Description: plug_62000311722_URL_Link; ComponentLink2URL: http://katalog.we-online.de/en/em/WTB_2_00_MALE_VERTICAL_SHROUDED_HEADER_6200XX11622

## Sheet ADC-RDC-FPGA.SchDoc
size A3
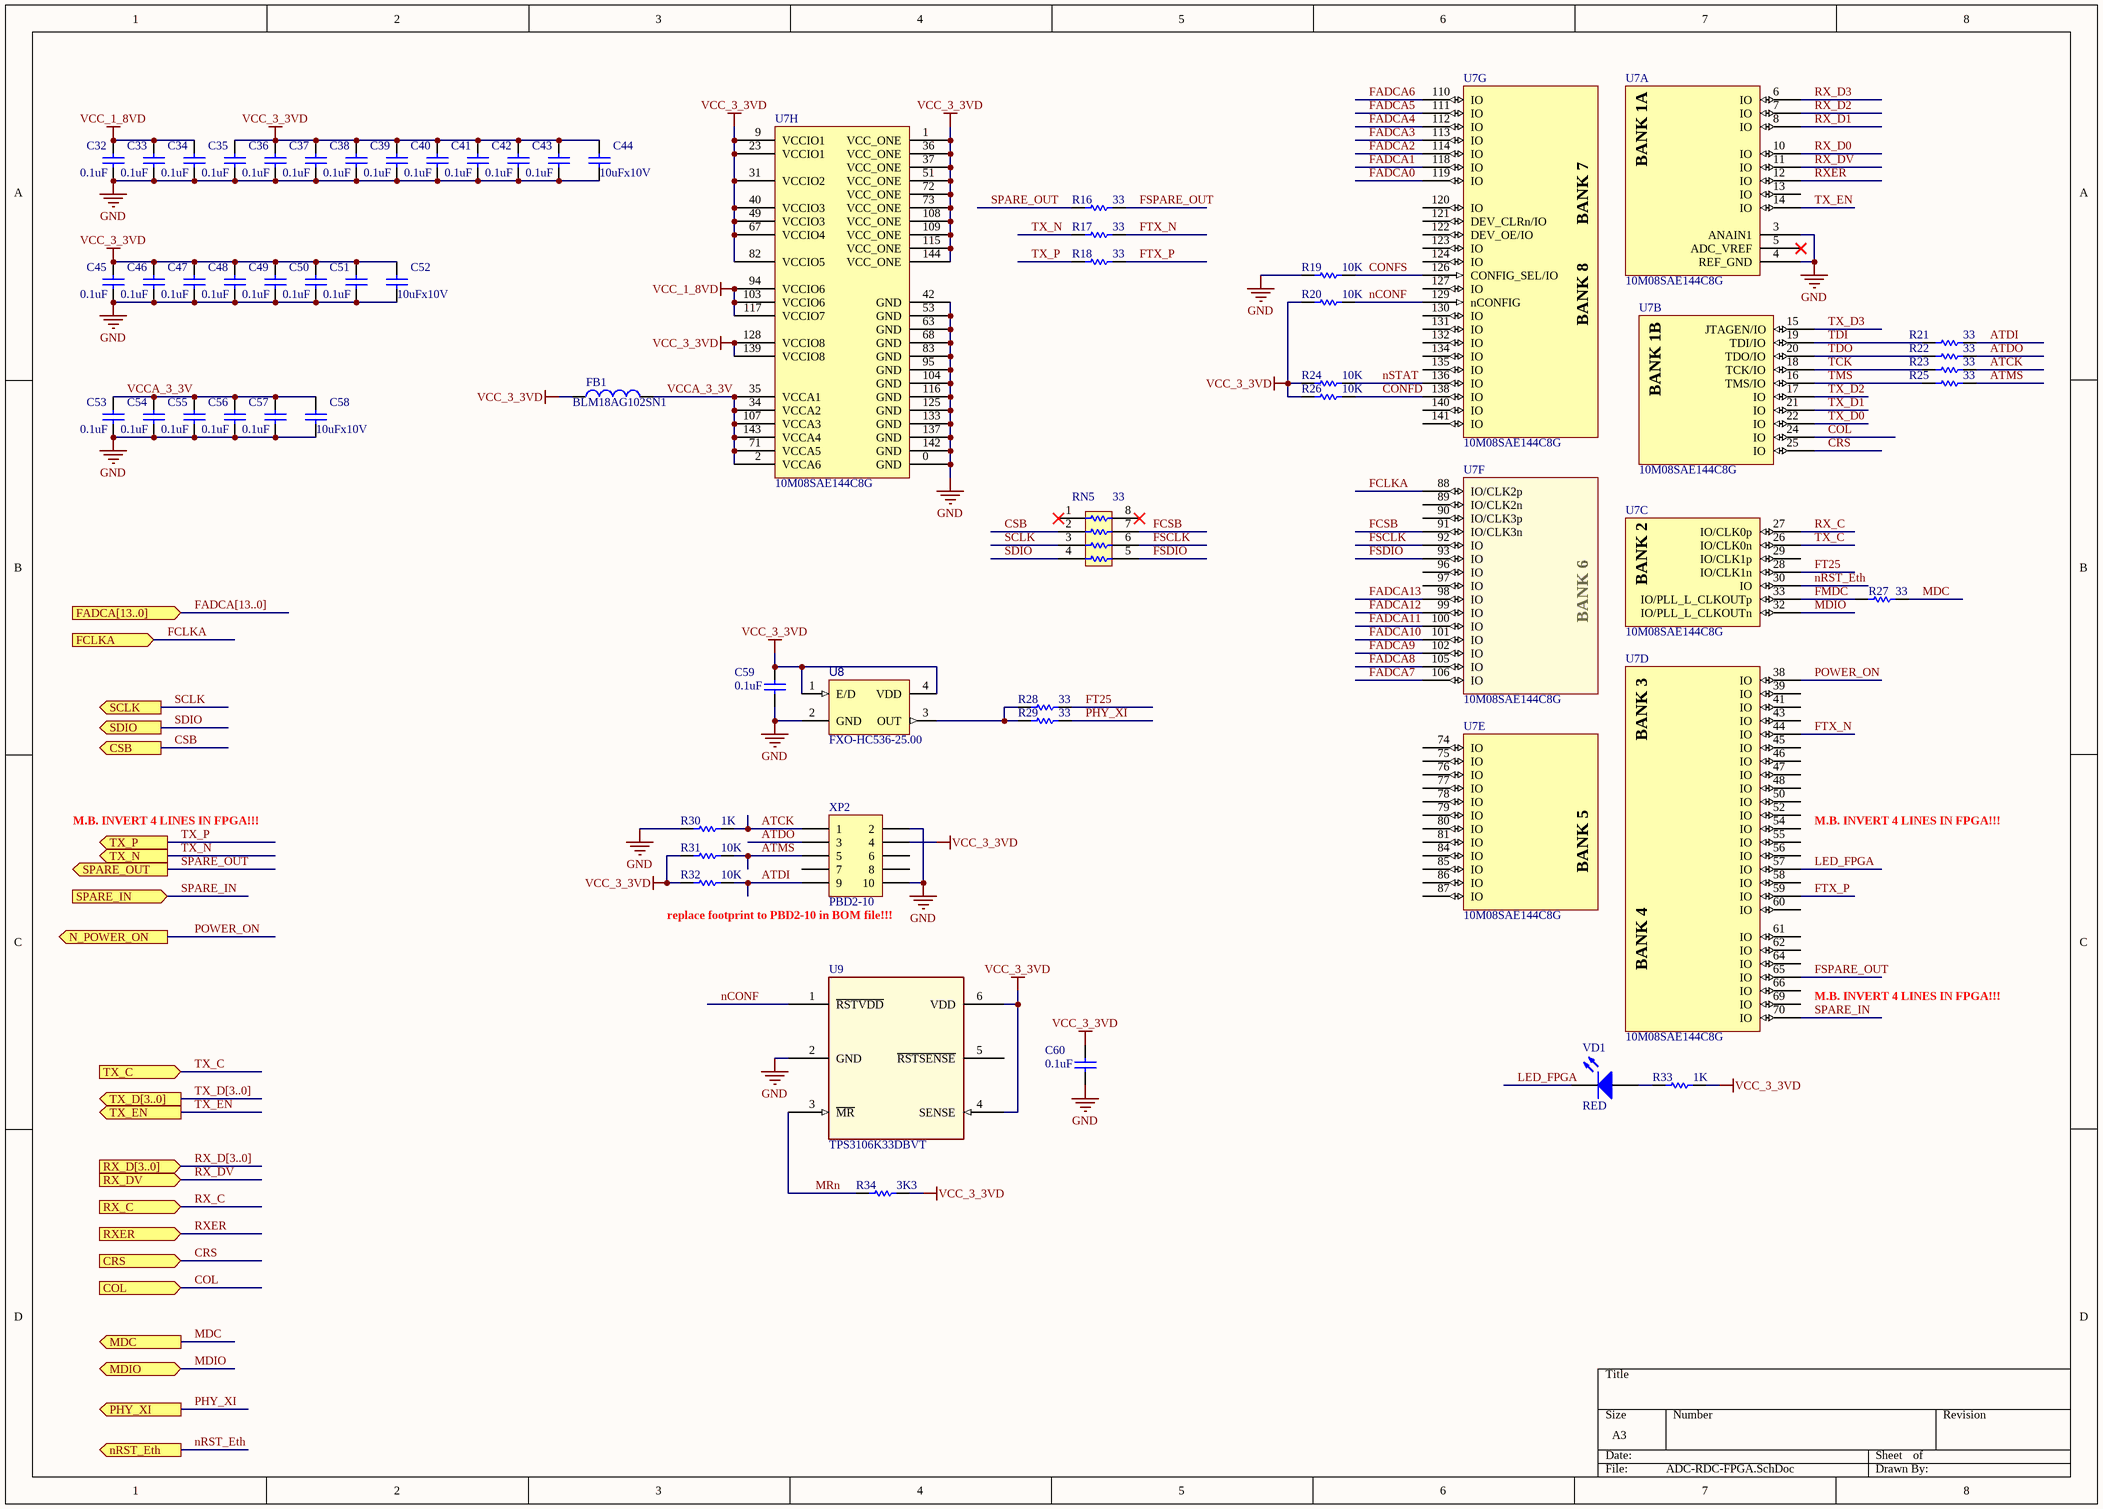
[diagram p5: ADC-RDC-FPGA.SchDoc]

### Parts
C32  0.1uF  [C0603]
C33  0.1uF  [C0603]
C34  0.1uF  [C0603]
C35  0.1uF  [C0603]
C36  0.1uF  [C0603]
C37  0.1uF  [C0603]
C38  0.1uF  [C0603]
C39  0.1uF  [C0603]
C40  0.1uF  [C0603]
C41  0.1uF  [C0603]
C42  0.1uF  [C0603]
C43  0.1uF  [C0603]
C44  10uFx10V  [C0805]
C45  0.1uF  [C0603]
C46  0.1uF  [C0603]
C47  0.1uF  [C0603]
C48  0.1uF  [C0603]
C49  0.1uF  [C0603]
C50  0.1uF  [C0603]
C51  0.1uF  [C0603]
C52  10uFx10V  [C0805]
C53  0.1uF  [C0603]
C54  0.1uF  [C0603]
C55  0.1uF  [C0603]
C56  0.1uF  [C0603]
C57  0.1uF  [C0603]
C58  10uFx10V  [C0805]
C59  0.1uF  [C0603]
C60  0.1uF  [C0603]
FB1  BLM18AG102SN1  [R0603]
R16  33  [R0603]
R17  33  [R0603]
R18  33  [R0603]
R19  10K  [R0603]
R20  10K  [R0603]
R21  33  [R0603]
R22  33  [R0603]
R23  33  [R0603]
R24  10K  [R0603]
R25  33  [R0603]
R26  10K  [R0603]
R27  33  [R0603]
R28  33  [R0603]
R29  33  [R0603]
R30  1K  [R0603]
R31  10K  [R0603]
R32  10K  [R0603]
R33  1K  [R0603]
R34  3K3  [R0603]
RN5  33  [EXB38V]
U7  10M08SAE144C8G  [EQFP144_L]  (parts A,B,C,D,E,F,G,H of 8)
U8  FXO-HC536-25.00  [HC5]
U9  TPS3106K33DBVT  [SOT23-6]
VD1  RED  [D0805]
XP2  PBD2-10  [PLD2-10]

### Ports
COL (in), CRS (in), CSB (out), FADCA[13..0] (in), FCLKA (in), MDC (out), MDIO (bidir), N_POWER_ON (out), nRST_Eth (out), PHY_XI (out), RX_C (in), RX_D[3..0] (in), RX_DV (in), RXER (in), SCLK (out), SDIO (out), SPARE_IN (in), SPARE_OUT (out), TX_C (in), TX_D[3..0] (out), TX_EN (out), TX_N (out), TX_P (out)

### Nets
GND: C32.1 C33.1 C34.1 C35.1 C36.1 C37.1 C38.1 C39.1 C40.1 C41.1 C42.1 C43.1 C44.2 C45.1 C46.1 C47.1 C48.1 C49.1 C50.1 C51.1 C52.2 C53.1 C54.1 C55.1 C56.1 C57.1 C58.2 C59.1 C60.1 R19.1 R30.1 U7.0(GND) U7.3(ANAIN1) U7.4(REF_GND) U7.42(GND) U7.53(GND) U7.63(GND) U7.68(GND) U7.83(GND) U7.95(GND) U7.104(GND) U7.116(GND) U7.125(GND) U7.133(GND) U7.137(GND) U7.142(GND) U8.2(GND) U9.2(GND) XP2.2 XP2.10
VCC_1_8VD: C32.2 C33.2 C34.2 U7.94(VCCIO6) U7.103(VCCIO6) U7.117(VCCIO7)
VCC_3_3VD: C35.2 C36.2 C37.2 C38.2 C39.2 C40.2 C41.2 C42.2 C43.2 C44.1 C45.2 C46.2 C47.2 C48.2 C49.2 C50.2 C51.2 C52.1 C59.2 C60.2 FB1.2 R20.1 R24.1 R26.1 R31.1 R32.1 R33.1 R34.2 U7.1(VCC_ONE) U7.9(VCCIO1) U7.23(VCCIO1) U7.31(VCCIO2) U7.36(VCC_ONE) U7.37(VCC_ONE) U7.40(VCCIO3) U7.49(VCCIO3) U7.51(VCC_ONE) U7.67(VCCIO4) U7.72(VCC_ONE) U7.73(VCC_ONE) U7.82(VCCIO5) U7.108(VCC_ONE) U7.109(VCC_ONE) U7.115(VCC_ONE) U7.128(VCCIO8) U7.139(VCCIO8) U7.144(VCC_ONE) U8.1(E/D) U8.4(VDD) U9.4(SENSE) U9.6(VDD) XP2.4
ATCK: R23.2 R30.2 XP2.1
ATDI: R21.2 R32.2 XP2.9
ATDO: R22.2 XP2.3
ATMS: R25.2 R31.2 XP2.5
COL: U7.24(IO) ; port COL
CONFD: R26.2 U7.138(IO)
CONFS: R19.2 U7.126(CONFIG_SEL/IO)
CRS: U7.25(IO) ; port CRS
CSB: RN5.2 ; port CSB
FADCA0: U7.119(IO)
FADCA1: U7.118(IO)
FADCA2: U7.114(IO)
FADCA3: U7.113(IO)
FADCA4: U7.112(IO)
FADCA5: U7.111(IO)
FADCA6: U7.110(IO)
FADCA7: U7.106(IO)
FADCA8: U7.105(IO)
FADCA9: U7.102(IO)
FADCA10: U7.101(IO)
FADCA11: U7.100(IO)
FADCA12: U7.99(IO)
FADCA13: U7.98(IO)
FCLKA: U7.88(IO/CLK2p) ; port FCLKA
FCSB: RN5.7 U7.91(IO/CLK3n)
FMDC: R27.1 U7.33(IO/PLL_L_CLKOUTp)
FSCLK: RN5.6 U7.92(IO)
FSDIO: RN5.5 U7.93(IO)
FSPARE_OUT: R16.2 U7.65(IO)
FT25: R28.2 U7.28(IO/CLK1n)
FTX_N: R17.2 U7.44(IO)
FTX_P: R18.2 U7.59(IO)
LED_FPGA: U7.57(IO) VD1.2(K)
MDC: R27.2 ; port MDC
MDIO: U7.32(IO/PLL_L_CLKOUTn) ; port MDIO
MRn: R34.1 U9.3(~{MR})
nCONF: R20.2 U7.129(nCONFIG) U9.1(~{RSTVDD})
nRST_Eth: U7.30(IO) ; port nRST_Eth
nSTAT: R24.2 U7.136(IO)
PHY_XI: R29.2 ; port PHY_XI
POWER_ON: U7.38(IO) ; port N_POWER_ON  [project net N_POWER_ON]
RX_C: U7.27(IO/CLK0p) ; port RX_C
RX_D0: U7.10(IO)
RX_D1: U7.8(IO)
RX_D2: U7.7(IO)
RX_D3: U7.6(IO)
RX_DV: U7.11(IO) ; port RX_DV
RXER: U7.12(IO) ; port RXER
SCLK: RN5.3 ; port SCLK
SDIO: RN5.4 ; port SDIO
SPARE_IN: U7.70(IO) ; port SPARE_IN
SPARE_OUT: R16.1 ; port SPARE_OUT
TCK: R23.1 U7.18(TCK/IO)
TDI: R21.1 U7.19(TDI/IO)
TDO: R22.1 U7.20(TDO/IO)
TMS: R25.1 U7.16(TMS/IO)
TX_C: U7.26(IO/CLK0n) ; port TX_C
TX_D0: U7.22(IO)
TX_D1: U7.21(IO)
TX_D2: U7.17(IO)
TX_D3: U7.15(JTAGEN/IO)
TX_EN: U7.14(IO) ; port TX_EN
TX_N: R17.1 ; port TX_N
TX_P: R18.1 ; port TX_P
VCCA_3_3V: C53.2 C54.2 C55.2 C56.2 C57.2 C58.1 FB1.1 U7.2(VCCA6) U7.34(VCCA2) U7.35(VCCA1) U7.71(VCCA5) U7.107(VCCA3) U7.143(VCCA4)
NetR28_1: R28.1 R29.1 U8.3(OUT)
NetR33_2: R33.2 VD1.1(A)

Not connected (* = marked no-connect by the designer): RN5 1* 8*; U7 5(ADC_VREF)* 13(IO) 29(IO/CLK1p) 39(IO) 41(IO) 43(IO) 45(IO) 46(IO) 47(IO) 48(IO) 50(IO) 52(IO) 54(IO) 55(IO) 56(IO) 58(IO) 60(IO) 61(IO) 62(IO) 64(IO) 66(IO) 69(IO) 74(IO) 75(IO) 76(IO) 77(IO) 78(IO) 79(IO) 80(IO) 81(IO) 84(IO) 85(IO) 86(IO) 87(IO) 89(IO/CLK2n) 90(IO/CLK3p) 96(IO) 97(IO) 120(IO) 121(DEV_CLRn/IO) 122(DEV_OE/IO) 123(IO) 124(IO) 127(IO) 130(IO) 131(IO) 132(IO) 134(IO) 135(IO) 140(IO) 141(IO); U9 5(~{RSTSENSE}); XP2 6 7 8

### Buses and harness runs
bus FADCA[13..0] = port FADCA[13..0]
bus RX_D[3..0] = port RX_D[3..0]
bus TX_D[3..0] = port TX_D[3..0]

### Notes on the sheet
- M.B. INVERT 4 LINES IN FPGA!!!
- replace footprint to PBD2-10 in BOM file!!!
- (in symbol 10M04SAE144C8G, part A) BANK 1A
- (in symbol 10M04SAE144C8G, part B) BANK 1B
- (in symbol 10M04SAE144C8G, part C) BANK 2
- (in symbol 10M04SAE144C8G, part D) BANK 3; BANK 4
- (in symbol 10M04SAE144C8G, part E) BANK 5
- (in symbol 10M04SAE144C8G, part F) BANK 6
- (in symbol 10M04SAE144C8G, part G) BANK 7; BANK 8

### Library data of the parts
C32-C60 = Cap: Capacitor, 2pin; ValueSCH: *; ValueBOM: *; MarkPCB: *
FB1 = Inductor: Inductor, 2pin; ValueSCH: *; ValueBOM: *; MarkPCB: *
R16-R34 = RES: Resistor, 2pin; ValueSCH: *; ValueBOM: *; MarkPCB: *
RN5 = x4 Resistor Array: ValueSCH: *; ValueBOM: *; MarkPCB: *
U7 = 10M04SAE144C8G: Cyclone III Family FPGA, 94 I/O Pins, 4 PLLs, 144-Pin EQFP, Speed Grade 8, Commercial Grade, Pb-Free; ValueBOM: *; ValueSCH: *; MarkPCB: *
U8 = SG-636PTF-40.0000: Surface Mount Crystal Oscillator; MarkPCB: *; ValueBOM: *; ValueSCH: *
U9 = TPS3106: MarkPCB: *; ValueBOM: *; ValueSCH: *
VD1 = LED: Typical GaAs LED; ValueSCH: *; ValueBOM: *; MarkPCB: *
XP2 = Header 5X2: Header, 5-Pin, Dual row; ValueSCH: *; ValueBOM: *; MarkPCB: *

## Nets that join several sheets
GND: ADC-RDC-ADC (42 pins), ADC-RDC-PHY (15 pins), ADC-RDC-Power (16 pins), ADC-RDC-IO (9 pins), ADC-RDC-FPGA (50 pins)
VCC_1_8VD: ADC-RDC-ADC (14 pins), ADC-RDC-FPGA (6 pins)
VCC_2_8VA: ADC-RDC-ADC (6 pins), ADC-RDC-Power (5 pins)
VCC_3_3VD: ADC-RDC-PHY (9 pins), ADC-RDC-Power (5 pins), ADC-RDC-IO (C71.2 C72.2 U11.5 U13.5), ADC-RDC-FPGA (52 pins)
VCC_4_3 VD: ADC-RDC-ADC (U6.1 U6.3), ADC-RDC-Power (12 pins)
COL: ADC-RDC-PHY (U10.28), ADC-RDC-FPGA (U7.24)
CRS: ADC-RDC-PHY (U10.29), ADC-RDC-FPGA (U7.25)
CSB: ADC-RDC-ADC (R11.2 U1.46), ADC-RDC-FPGA (RN5.2)
FADCA0: ADC-RDC-ADC (RN1.6), ADC-RDC-FPGA (U7.119)
FADCA1: ADC-RDC-ADC (RN1.7), ADC-RDC-FPGA (U7.118)
FADCA2: ADC-RDC-ADC (RN1.8), ADC-RDC-FPGA (U7.114)
FADCA3: ADC-RDC-ADC (RN2.5), ADC-RDC-FPGA (U7.113)
FADCA4: ADC-RDC-ADC (RN2.6), ADC-RDC-FPGA (U7.112)
FADCA5: ADC-RDC-ADC (RN2.7), ADC-RDC-FPGA (U7.111)
FADCA6: ADC-RDC-ADC (RN2.8), ADC-RDC-FPGA (U7.110)
FADCA7: ADC-RDC-ADC (RN3.5), ADC-RDC-FPGA (U7.106)
FADCA8: ADC-RDC-ADC (RN3.6), ADC-RDC-FPGA (U7.105)
FADCA9: ADC-RDC-ADC (RN3.7), ADC-RDC-FPGA (U7.102)
FADCA10: ADC-RDC-ADC (RN3.8), ADC-RDC-FPGA (U7.101)
FADCA11: ADC-RDC-ADC (RN4.5), ADC-RDC-FPGA (U7.100)
FADCA12: ADC-RDC-ADC (RN4.6), ADC-RDC-FPGA (U7.99)
FADCA13: ADC-RDC-ADC (RN4.7), ADC-RDC-FPGA (U7.98)
FCLKA: ADC-RDC-ADC (RN1.5), ADC-RDC-FPGA (U7.88)
MDC: ADC-RDC-PHY (U10.12), ADC-RDC-FPGA (R27.2)
MDIO: ADC-RDC-PHY (R36.2 U10.11), ADC-RDC-FPGA (U7.32)
N_POWER_ON: ADC-RDC-IO (R46.1), ADC-RDC-FPGA (U7.38)
nRST_Eth: ADC-RDC-PHY (VD4.1), ADC-RDC-FPGA (U7.30)
PHY_XI: ADC-RDC-PHY (U10.9), ADC-RDC-FPGA (R29.2)
RX_C: ADC-RDC-PHY (R38.1), ADC-RDC-FPGA (U7.27)
RX_D0: ADC-RDC-PHY (R42.1 U10.16), ADC-RDC-FPGA (U7.10)
RX_D1: ADC-RDC-PHY (U10.15), ADC-RDC-FPGA (U7.8)
RX_D2: ADC-RDC-PHY (U10.14), ADC-RDC-FPGA (U7.7)
RX_D3: ADC-RDC-PHY (U10.13), ADC-RDC-FPGA (U7.6)
RX_DV: ADC-RDC-PHY (U10.18), ADC-RDC-FPGA (U7.11)
RXER: ADC-RDC-PHY (U10.20), ADC-RDC-FPGA (U7.12)
SCLK: ADC-RDC-ADC (R9.2 U1.45), ADC-RDC-FPGA (RN5.3)
SDIO: ADC-RDC-ADC (R10.2 U1.44), ADC-RDC-FPGA (RN5.4)
SPARE_IN: ADC-RDC-IO (R51.2), ADC-RDC-FPGA (U7.70)
SPARE_OUT: ADC-RDC-IO (U13.1), ADC-RDC-FPGA (R16.1)
TX_C: ADC-RDC-PHY (R39.1), ADC-RDC-FPGA (U7.26)
TX_D0: ADC-RDC-PHY (U10.24), ADC-RDC-FPGA (U7.22)
TX_D1: ADC-RDC-PHY (U10.25), ADC-RDC-FPGA (U7.21)
TX_D2: ADC-RDC-PHY (U10.26), ADC-RDC-FPGA (U7.17)
TX_D3: ADC-RDC-PHY (U10.27), ADC-RDC-FPGA (U7.15)
TX_EN: ADC-RDC-PHY (U10.23), ADC-RDC-FPGA (U7.14)
TX_N: ADC-RDC-IO (U11.3), ADC-RDC-FPGA (R17.1)
TX_P: ADC-RDC-IO (U11.1), ADC-RDC-FPGA (R18.1)